# Altium schematic sheet Sheet1.SchDoc
size 420 x 297 mm; Address1: Address1; Address2: Address2; Address3: Address3; Address4: Address4; DocumentNumber: АБВГ.123456.001 Э3; SheetNumber: 1; SheetTotal: 1; Scale: 1:1; DocumentType: Схема электрическая принципиальная; FirstReferrence: АБВГ.123456.001
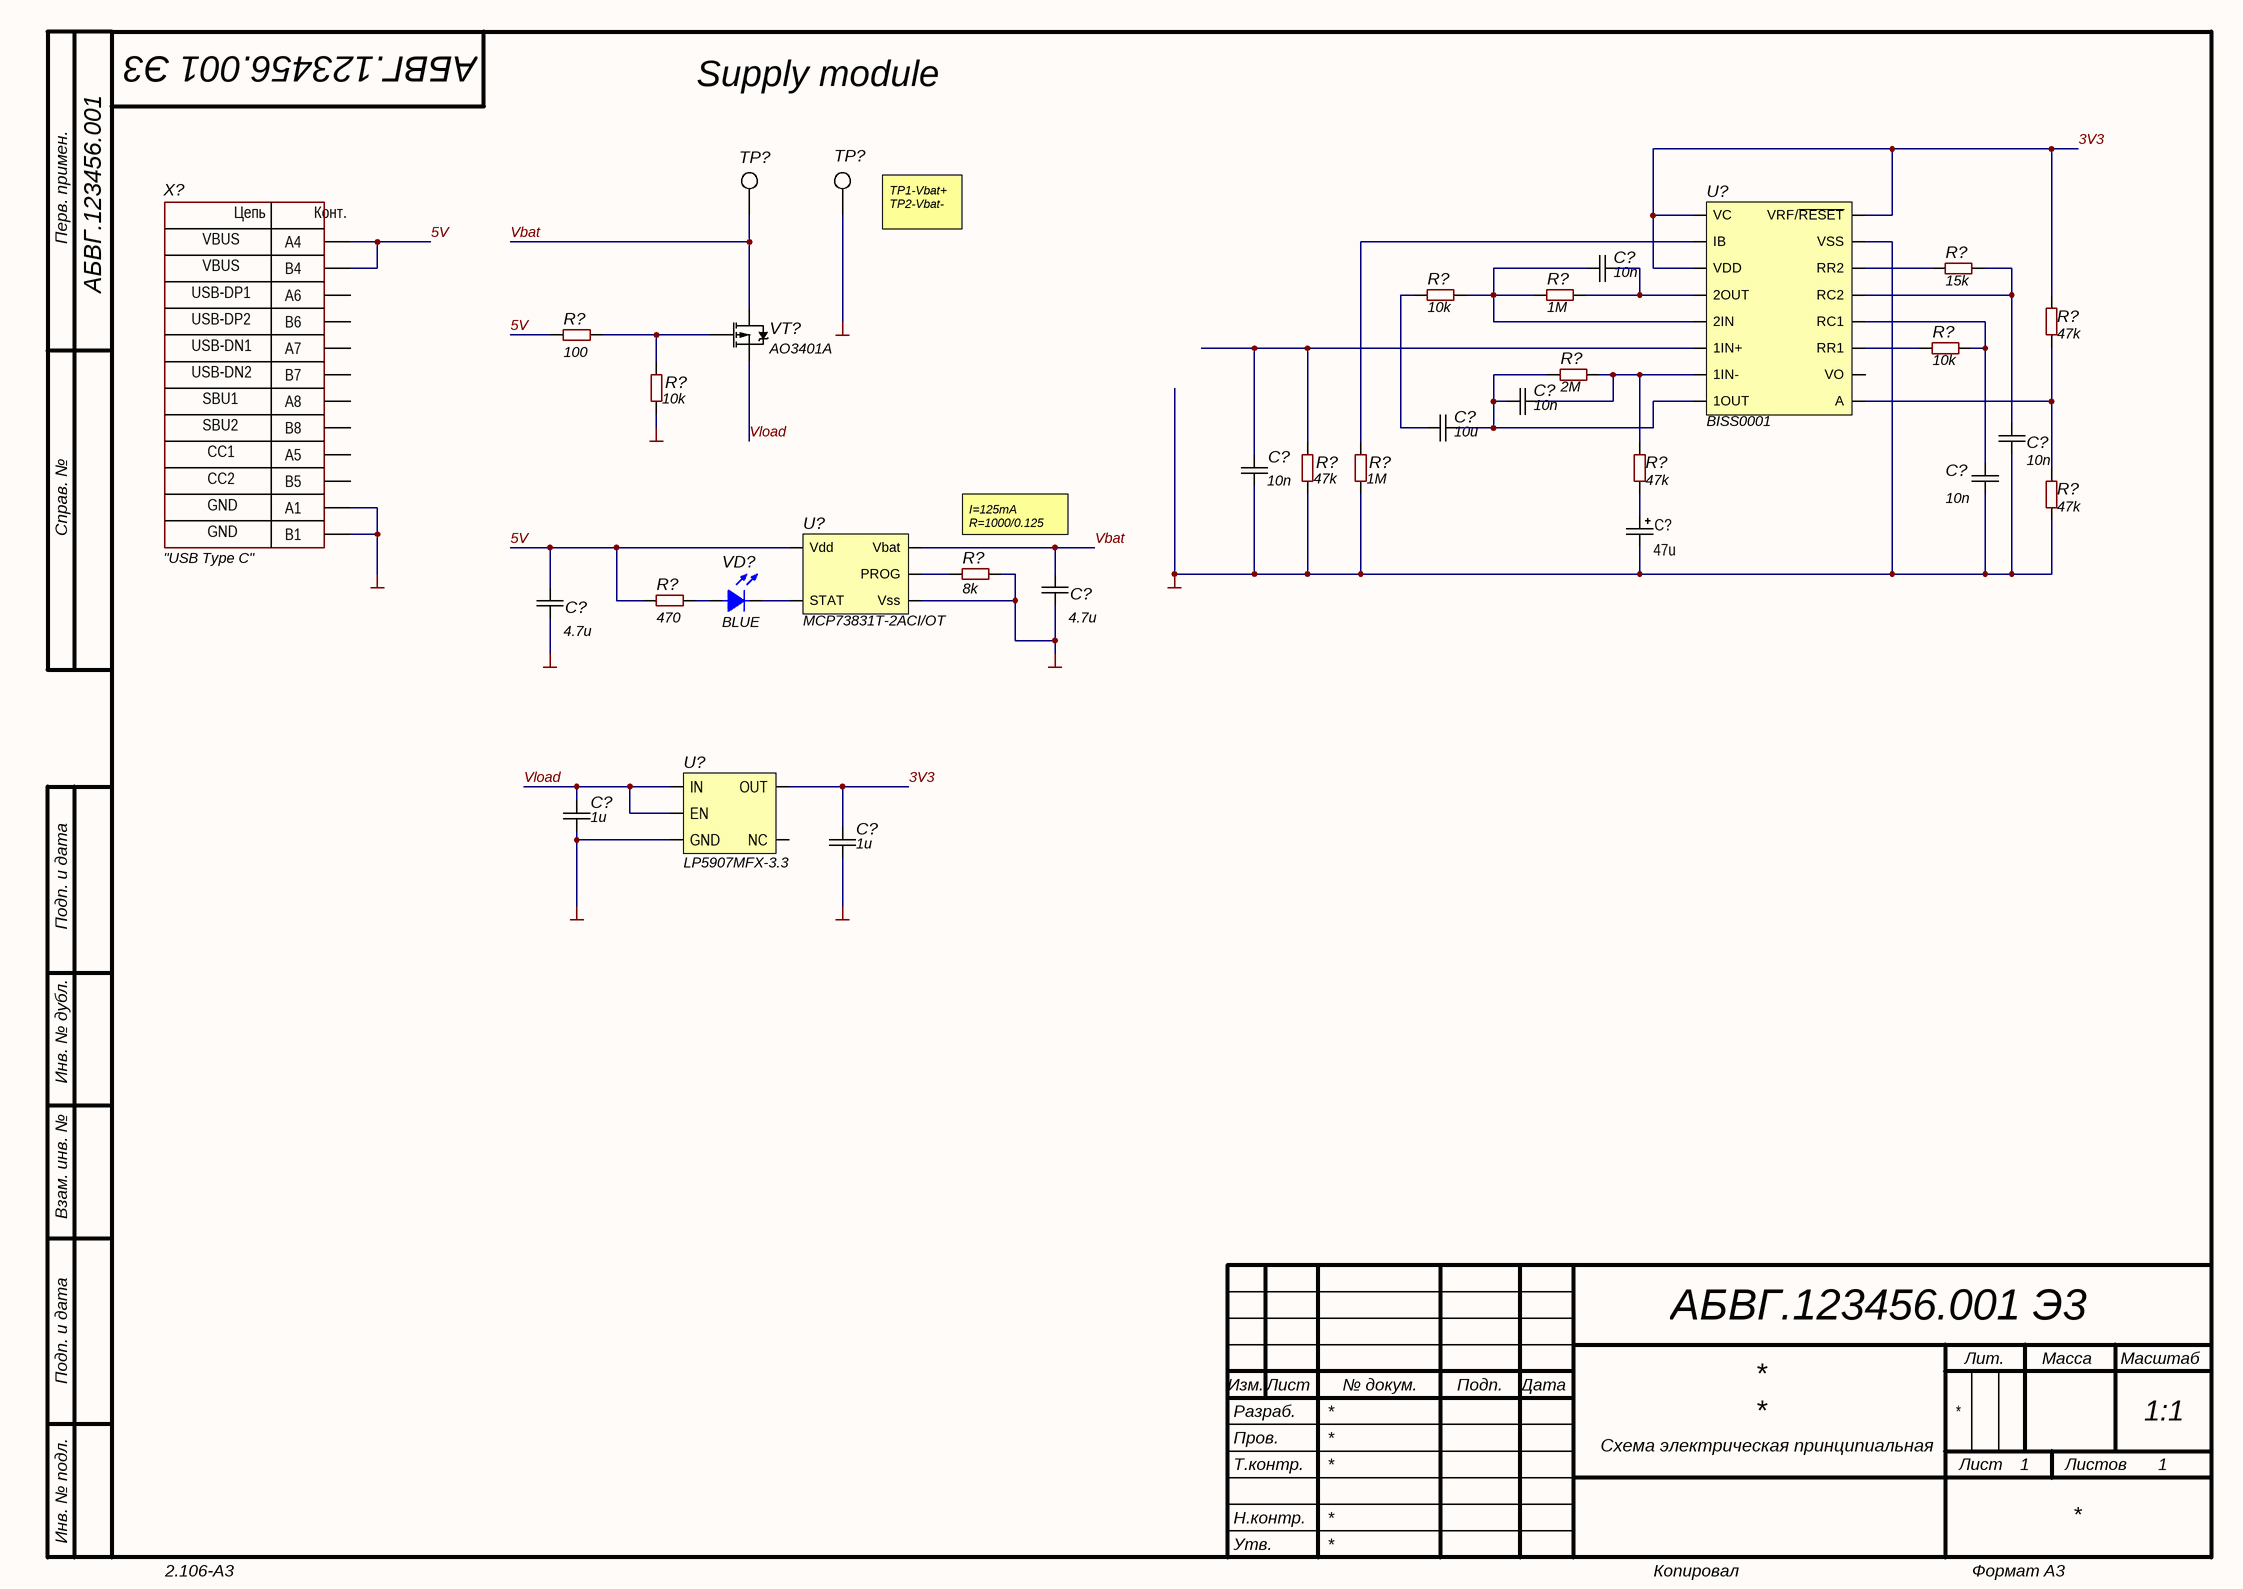
[diagram p0: Sheet1.SchDoc]

## Parts
(Parts that share a designator on the sheet are numbered #1, #2 ... from top to bottom, then left to right.)
C?#1  value 10n  [CAP: 0603]
C?#2  value 10n  [CAP: 0603]
C?#3  value 10u  [CAP: 0603]
C?#4  value 10n  [CAP: 0603]
C?#5  value 10n  [CAP: 0603]
C?#6  value 10n  [CAP: 0603]
C?#7  value 47u  [CAP: TANTAL-B]
C?#8  value 4.7u  [CAP: 0603]
C?#9  value 4.7u  [CAP: 0603]
C?#10  value 1u  [CAP: 0603]
C?#11  value 1u  [CAP: 0603]
R?#1  value 15k  [RES: 0603]
R?#2  value 10k  [RES: 0603]
R?#3  value 1M  [RES: 0603]
R?#4  value 47k  [RES: 0603]
R?#5  value 100  [RES: 0603]
R?#6  value 10k  [RES: 0603]
R?#7  value 2M  [RES: 0603]
R?#8  value 10k  [RES: 0603]
R?#9  value 47k  [RES: 0603]
R?#10  value 47k  [RES: 0603]
R?#11  value 47k  [RES: 0603]
R?#12  value 1M  [RES: 0603]
R?#13  value 8k  [RES: 0603]
R?#14  value 470  [RES: 0603]
TP?#1  Testpoint_HS1mm  [TestPoint(without 3D)]  (value not drawn)
TP?#2  Testpoint_HS1mm  [TestPoint(without 3D)]  (value not drawn)
U?#1  BISS0001  [16-SO]
U?#2  MCP73831T-2ACI/OT  [SOT23-5]
U?#3  LP5907MFX-3.3  [SOT23-5]
VD?  Color: BLUE  [LED: 0603B]
VT?  PartNumber: AO3401A  [SOT23]
X?  CommentText: "USB Type C"  [CON: TYPE-C-31-M-12]

## Nets
GND: C?#4.1 C?#5.2 C?#6.2 C?#7.2 C?#8.1 C?#9.1 C?#10.1 C?#11.1 R?#8.1 R?#10.2 R?#11.1 R?#12.1 R?#13.1 TP?#2.1 U?#1.7(VSS) U?#2.2(Vss) U?#3.2(GND) X?.A1 X?.B1
3V3: C?#11.2 R?#4.1 U?#1.8(VRF/~{RESET}) U?#1.9(VC) U?#1.11(VDD) U?#3.5(OUT)
5V: C?#9.2 R?#5.1 R?#14.2 U?#2.4(Vdd) X?.A4 X?.B4
Vbat: C?#8.2 TP?#1.1 U?#2.3(Vbat) VT?.2(D)
Vload: C?#10.2 U?#3.1(IN) U?#3.3(EN) VT?.3(S)
NetC?#1_1: C?#1.1 R?#3.1 U?#1.12(2OUT)
NetC?#1_2: C?#1.2 R?#2.1 R?#3.2 U?#1.13(2IN)
NetC?#2_1: C?#2.1 R?#7.1 R?#9.1 U?#1.15(1IN-)
NetC?#2_2: C?#2.2 C?#3.1 R?#7.2 U?#1.16(1OUT)
NetC?#3_2: C?#3.2 R?#2.2
NetC?#4_2: C?#4.2 R?#11.2 U?#1.14(1IN+)
NetC?#5_1: C?#5.1 R?#1.1 U?#1.5(RC2)
NetC?#6_1: C?#6.1 R?#6.1 U?#1.4(RC1)
NetC?#7_1: C?#7.1 R?#9.2
NetR?#1_2: R?#1.2 U?#1.6(RR2)
NetR?#4_2: R?#4.2 R?#10.1 U?#1.1(A)
NetR?#5_2: R?#5.2 R?#8.2 VT?.1(G)
NetR?#6_2: R?#6.2 U?#1.3(RR1)
NetR?#12_2: R?#12.2 U?#1.10(IB)
NetR?#13_2: R?#13.2 U?#2.5(PROG)
NetR?#14_1: R?#14.1 VD?.1(A)
NetU?#2_1: U?#2.1(STAT) VD?.2(C)

Not connected (* = marked no-connect by the designer): U?#1 2(VO); U?#3 4(NC); X? A5 A6 A7 A8 B5 B6 B7 B8

## Notes on the sheet
- Supply module
- (near TP?#2) TP1-Vbat+
  TP2-Vbat-
- I=125mA
  R=1000/0.125
- Перв. примен.
- Справ. №
- Подп. и дата
- Инв. № дубл.
- Взам. инв. №
- Разраб.
- Изм.
- Лист
- № докум.
- Подп.
- Дата
- Лит.
- Масса
- Масштаб
- Пров.
- Т.контр.
- Листов
- Инв. № подл.
- Утв.
- Н.контр.
- 2.106-A3
- Копировал
- Формат А3
- (in symbol Connector_USB_Type_C) Цепь; Конт.; VBUS; USB-DP1; USB-DP2; USB-DN1; USB-DN2; SBU1; SBU2; CC1; CC2; GND

## Library data of the parts
C?#1 C?#2 C?#4-C?#6 = Ceramic_0603: Manufacturer: Yageo; PartNumber: CC0603KRX7R7BB104; ValueManufacturerPartNumber: Ceramic capacitor, 10n, X7R, ±10%, 16V, 0603, -55...+125°C; TypeCapacitor: Ceramic capacitor; Tolerance: ±10%; TypeDielectric: X7R; Voltage: 16V; Package: 0603; HelpURL: https://www.digikey.com/product-detail/en/yageo/CC0603KRX7R7BB104/311-1088-1-ND/302998; Temperature: -55...+125°C
C?#3 = Ceramic_0603: Manufacturer: Yageo; PartNumber: CC0603KRX7R7BB104; ValueManufacturerPartNumber: Ceramic capacitor, 10u, X7R, ±10%, 16V, 0603, -55...+125°C; TypeCapacitor: Ceramic capacitor; Tolerance: ±10%; TypeDielectric: X7R; Voltage: 16V; Package: 0603; HelpURL: https://www.digikey.com/product-detail/en/yageo/CC0603KRX7R7BB104/311-1088-1-ND/302998; Temperature: -55...+125°C
C?#7 = Tantal_B: Manufacturer: AVX; PartNumber: F930J227KBA; ValueManufacturerPartNumber: Tantalum capacitor, 47u, 6.3V, ±10%, 1.2Ohm, case B (3528), -55...+125°C; Impedance: 1.2Ohm; Tolerance: ±10%; TypeDielectric: X7R; TypeCapacitor: Tantalum capacitor; Voltage: 6.3V; Package: case B (3528); HelpURL: https://www.digikey.com/product-detail/en/avx-corporation/F930J227KBA/478-8166-1-ND/4005570; Temperature: -55...+125°C
C?#8 C?#9 = Ceramic_0603: Manufacturer: Yageo; PartNumber: CC0603KRX7R7BB104; ValueManufacturerPartNumber: Ceramic capacitor, 4.7u, X7R, ±10%, 16V, 0603, -55...+125°C; TypeCapacitor: Ceramic capacitor; Tolerance: ±10%; TypeDielectric: X7R; Voltage: 16V; Package: 0603; HelpURL: https://www.digikey.com/product-detail/en/yageo/CC0603KRX7R7BB104/311-1088-1-ND/302998; Temperature: -55...+125°C
C?#10 C?#11 = Ceramic_0603: Manufacturer: Yageo; PartNumber: CC0603KRX7R7BB104; ValueManufacturerPartNumber: Ceramic capacitor, 1u, X7R, ±10%, 16V, 0603, -55...+125°C; TypeCapacitor: Ceramic capacitor; Tolerance: ±10%; TypeDielectric: X7R; Voltage: 16V; Package: 0603; HelpURL: https://www.digikey.com/product-detail/en/yageo/CC0603KRX7R7BB104/311-1088-1-ND/302998; Temperature: -55...+125°C
R?#1 = Resistor_0603: Manufacturer: Yageo; PartNumber: RC0603JR-07100RL; ValueManufacturerPartNumber: Resistor film, 15k, ±5%, 0603, 0.1W, -55...+125°C; TypeResistor: Resistor film; Power: 0.1W; Tolerance: ±5%; Package: 0603; HelpURL: https://www.digikey.com/product-detail/en/yageo/RC0603JR-07100RL/311-100GRCT-ND/729644; Temperature: -55...+125°C
R?#2 R?#6 R?#8 = Resistor_0603: Manufacturer: Yageo; PartNumber: RC0603JR-07100RL; ValueManufacturerPartNumber: Resistor film, 10k, ±5%, 0603, 0.1W, -55...+125°C; TypeResistor: Resistor film; Power: 0.1W; Tolerance: ±5%; Package: 0603; HelpURL: https://www.digikey.com/product-detail/en/yageo/RC0603JR-07100RL/311-100GRCT-ND/729644; Temperature: -55...+125°C
R?#3 R?#12 = Resistor_0603: Manufacturer: Yageo; PartNumber: RC0603JR-07100RL; ValueManufacturerPartNumber: Resistor film, 1M, ±5%, 0603, 0.1W, -55...+125°C; TypeResistor: Resistor film; Power: 0.1W; Tolerance: ±5%; Package: 0603; HelpURL: https://www.digikey.com/product-detail/en/yageo/RC0603JR-07100RL/311-100GRCT-ND/729644; Temperature: -55...+125°C
R?#4 R?#9-R?#11 = Resistor_0603: Manufacturer: Yageo; PartNumber: RC0603JR-07100RL; ValueManufacturerPartNumber: Resistor film, 47k, ±5%, 0603, 0.1W, -55...+125°C; TypeResistor: Resistor film; Power: 0.1W; Tolerance: ±5%; Package: 0603; HelpURL: https://www.digikey.com/product-detail/en/yageo/RC0603JR-07100RL/311-100GRCT-ND/729644; Temperature: -55...+125°C
R?#5 = Resistor_0603: Manufacturer: Yageo; PartNumber: RC0603JR-07100RL; ValueManufacturerPartNumber: Resistor film, 100, ±5%, 0603, 0.1W, -55...+125°C; TypeResistor: Resistor film; Power: 0.1W; Tolerance: ±5%; Package: 0603; HelpURL: https://www.digikey.com/product-detail/en/yageo/RC0603JR-07100RL/311-100GRCT-ND/729644; Temperature: -55...+125°C
R?#7 = Resistor_0603: Manufacturer: Yageo; PartNumber: RC0603JR-07100RL; ValueManufacturerPartNumber: Resistor film, 2M, ±5%, 0603, 0.1W, -55...+125°C; TypeResistor: Resistor film; Power: 0.1W; Tolerance: ±5%; Package: 0603; HelpURL: https://www.digikey.com/product-detail/en/yageo/RC0603JR-07100RL/311-100GRCT-ND/729644; Temperature: -55...+125°C
R?#13 = Resistor_0603: Manufacturer: Yageo; PartNumber: RC0603JR-07100RL; ValueManufacturerPartNumber: Resistor film, 8k, ±5%, 0603, 0.1W, -55...+125°C; TypeResistor: Resistor film; Power: 0.1W; Tolerance: ±5%; Package: 0603; HelpURL: https://www.digikey.com/product-detail/en/yageo/RC0603JR-07100RL/311-100GRCT-ND/729644; Temperature: -55...+125°C
R?#14 = Resistor_0603: Manufacturer: Yageo; PartNumber: RC0603JR-07100RL; ValueManufacturerPartNumber: Resistor film, 470, ±5%, 0603, 0.1W, -55...+125°C; TypeResistor: Resistor film; Power: 0.1W; Tolerance: ±5%; Package: 0603; HelpURL: https://www.digikey.com/product-detail/en/yageo/RC0603JR-07100RL/311-100GRCT-ND/729644; Temperature: -55...+125°C
U?#1 = BISS0001: PIR Motion Detector; ComponentLink1Description: Datasheet; ComponentLink1URL: https://datasheetspdf.com/pdf/990807/SilvanChip/BISS0001/1
U?#2 = MCP73831T-2ACI/OT: Linear Charge Management Controller; ComponentLink1Description: Datasheet; ComponentLink1URL: https://ww1.microchip.com/downloads/aemDocuments/documents/APID/ProductDocuments/DataSheets/MCP73831-Family-Data-Sheet-DS20001984H.pdf
U?#3 = LP5907MFX-3.3: LDO 250 mA; ComponentLink1Description: Datasheet; ComponentLink1URL: https://www.ti.com/lit/ds/symlink/lp5907.pdf?ts=1629438025263&ref_url=https%253A%252F%252Fwww.google.com%252F
VD? = LED_single: ValueManufacturerPartNumber: LED, Green, *, *, *, -55...+150°C; TypeDiode: LED; ColorParameter: Green; Manufacturer: *; Package: *; HelpURL: *; Temperature: -55...+150°C; Current: *; VoltageDrop: *; PartNumber: *
VT? = MOSFET_P_123: Manufacturer: Infineon Technologies; ValueManufacturerPartNumber: MOSFET P-channel transistor, 20V, 2.6A, 2.9nC, 2.5W, 135mOhm, 220pF, SOT-23, -55...+150°C; TypeTransistor: MOSFET P-channel transistor; VoltageDS: 20V; CurrentDS: 2.6A; RDS: 135mOhm; GateCharge: 2.9nC; InputCapacitor: 220pF; MaxPower: 2.5W; Package: SOT-23; HelpURL: https://www.digikey.com/product-detail/en/infineon-technologies/IRLML2246TRPBF/IRLML2246TRPBFCT-ND/2639576; Temperature: -55...+150°C
X? = Connector_USB_Type_C: Manufacturer: Korean Hroparts; ValueManufacturerPartNumber: USB Type C, 3A; PartNumber: TYPE-C-31-M-12; TypeConnector: USB Type C; CurrentMax: 3A; HelpURL: https://lcsc.com/product-detail/USB-Type-C_Korean-Hroparts-Elec-TYPE-C-31-M-12_C165948.html